# EasyEDA Pro project e_oct_dice_Dec_2022.eprj, schematic e_oct_dice_sch_v0_3
Create Date: 2022-12-15; Page Name: P1; Project Name: e_oct_dice_Dec_2022; Schematic Name: e_oct_dice_sch_v0_3; Update Date: 2023-01-17; Company: CC BY-SA 4.0 International; Drawed: RONG BAO; Page Size: A4; Part Number: P1; Reviewed: RONG BAO; Version: v0.3
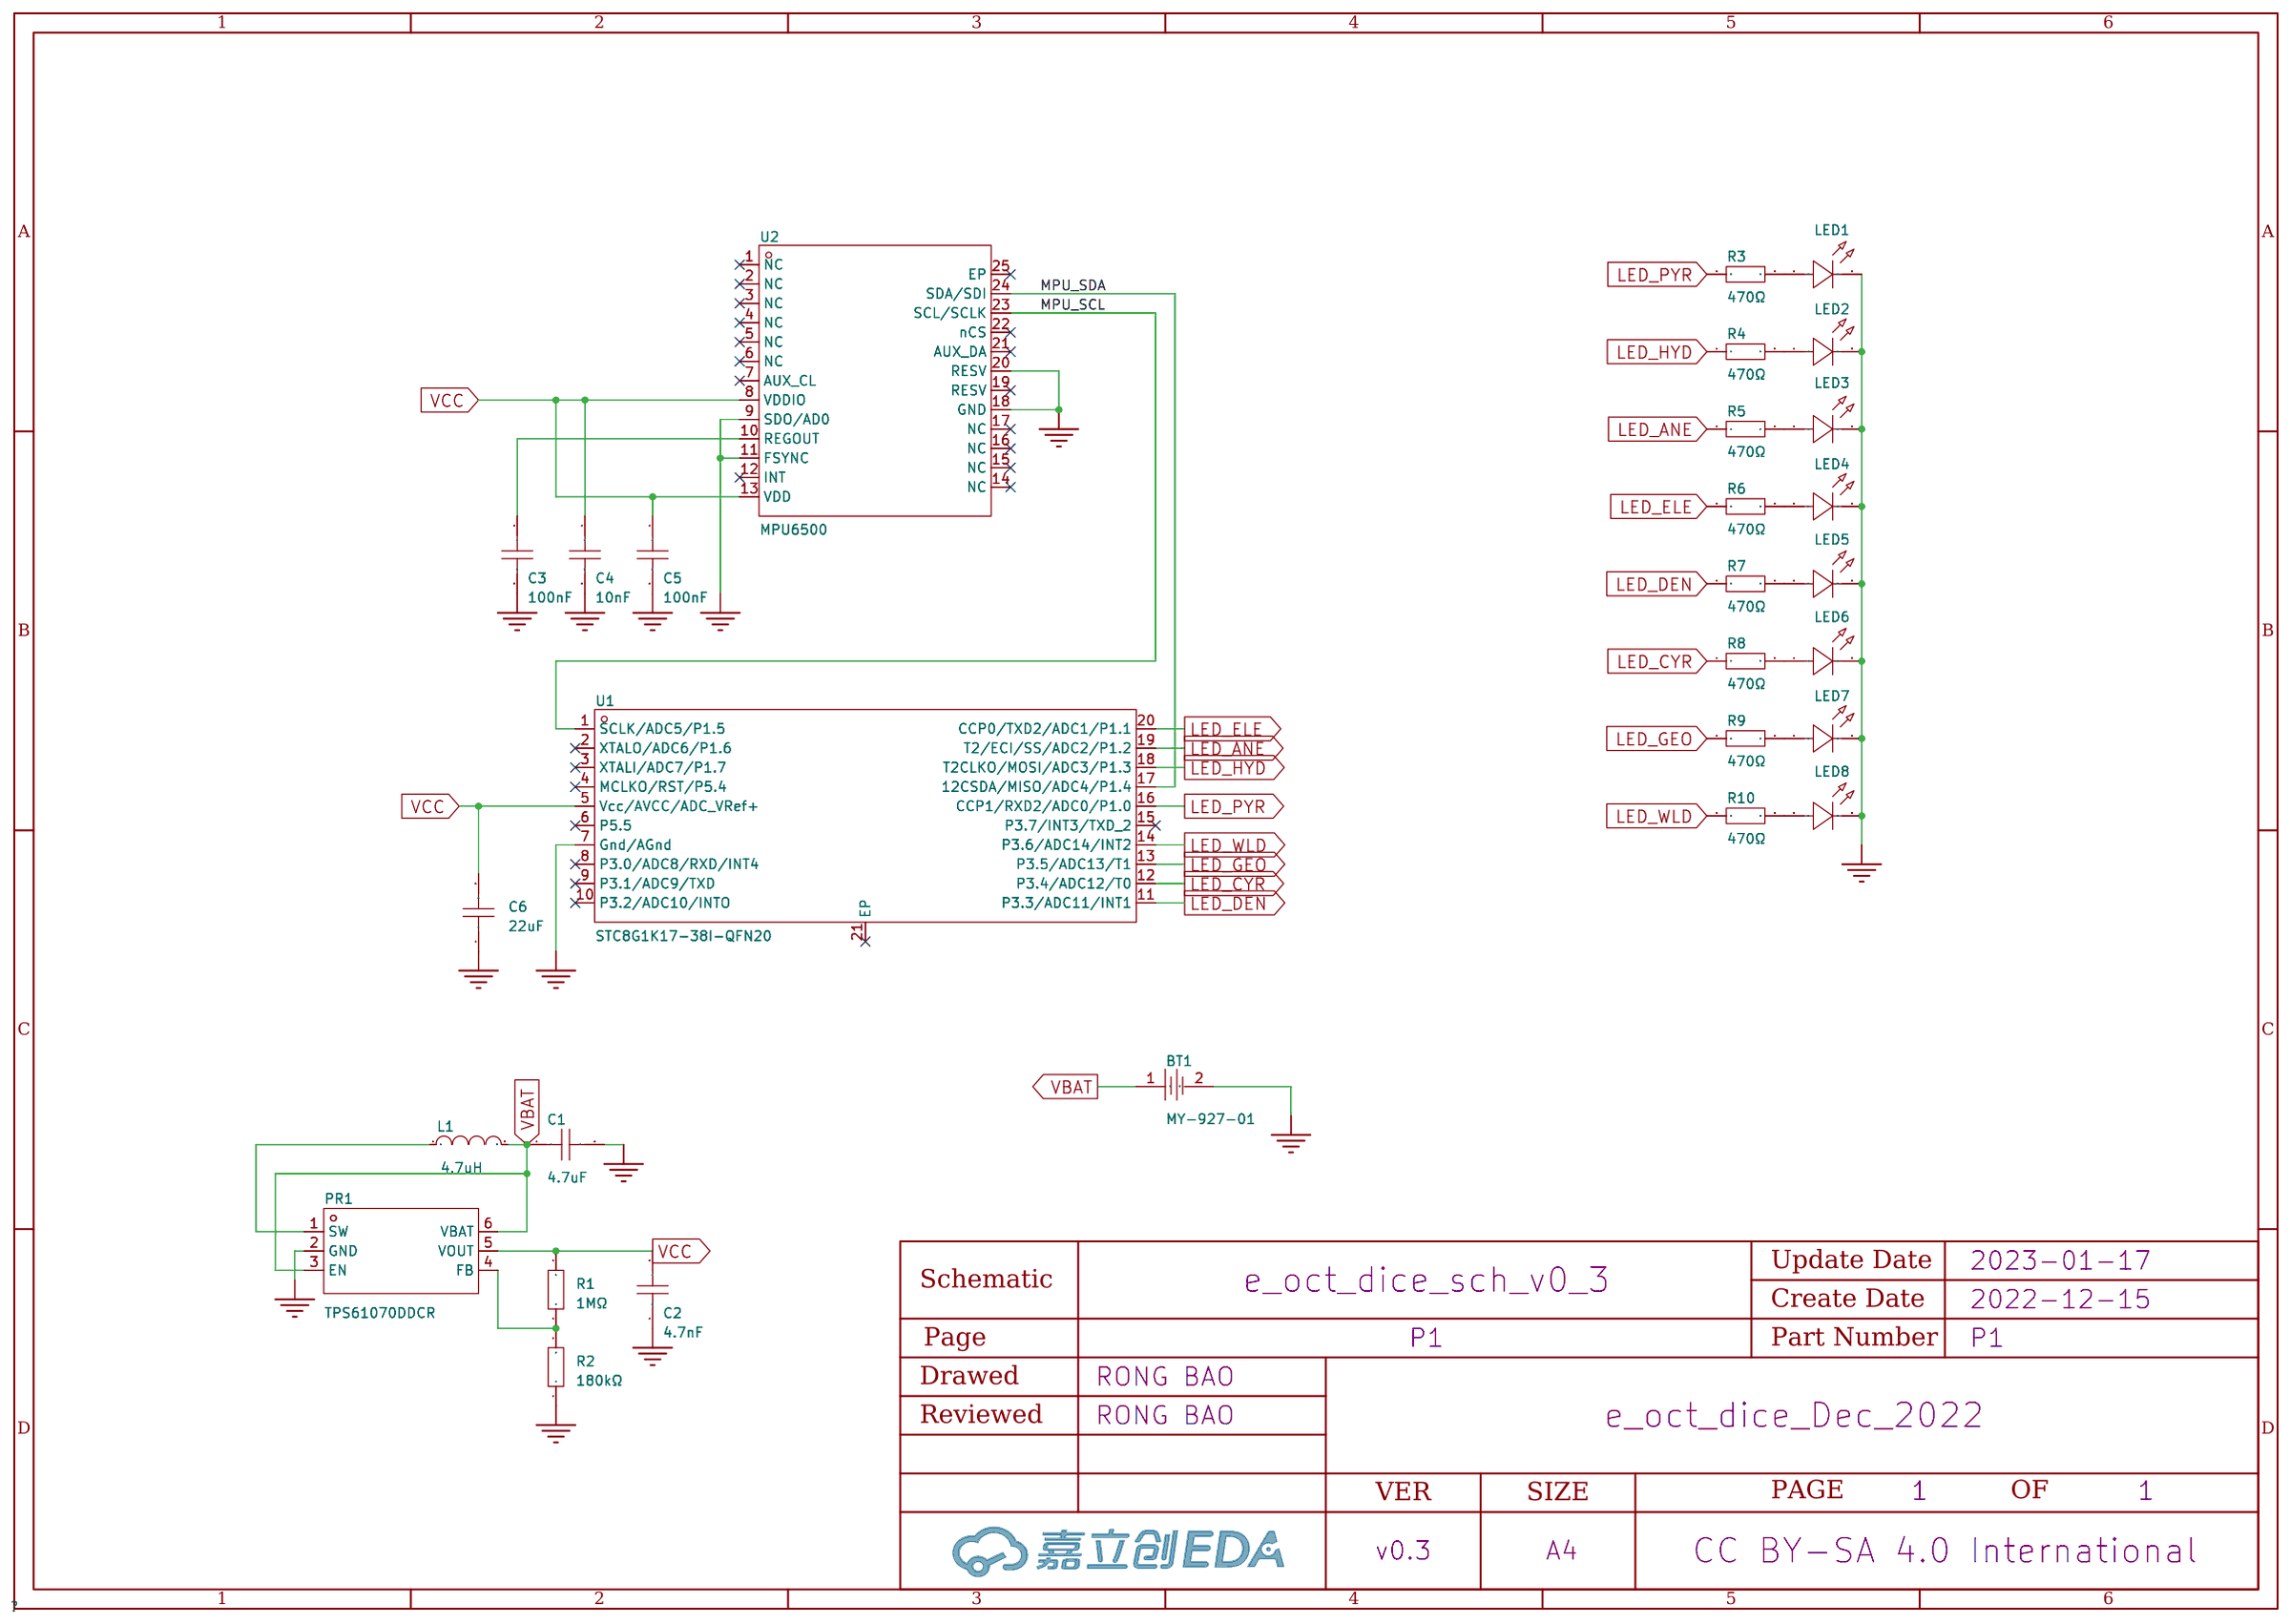
[diagram p1: schematic sheet]

## Parts
BT1  MY-927-01  [BAT-TH_MY-927-01]
C1  4.7uF  [C0402]
C2  4.7nF  [C0402]
C3  100nF  [C0402_NEW]
C4  10nF  [C0402]
C5  100nF  [C0402_NEW]
C6  22uF  [C0603]
L1  4.7uH  [L0603]
LED1  XL-302UWC  [LED-TH_BD3.8-P2.54-FD_WHITE]
LED2  XL-302UWC  [LED-TH_BD3.8-P2.54-FD_WHITE]
LED3  XL-302UWC  [LED-TH_BD3.8-P2.54-FD_WHITE]
LED4  XL-302UWC  [LED-TH_BD3.8-P2.54-FD_WHITE]
LED5  XL-302UWC  [LED-TH_BD3.8-P2.54-FD_WHITE]
LED6  XL-302UWC  [LED-TH_BD3.8-P2.54-FD_WHITE]
LED7  XL-302UWC  [LED-TH_BD3.8-P2.54-FD_WHITE]
LED8  XL-302UWC  [LED-TH_BD3.8-P2.54-FD_WHITE]
PR1  TPS61070DDCR  [SOT-23-6_L2.9-W1.6-P0.95-LS2.8-BR]
R1  1MΩ  [R0402]
R2  180kΩ  [R0603]
R3  470Ω  [R0402]
R4  470Ω  [R0402]
R5  470Ω  [R0402]
R6  470Ω  [R0402]
R7  470Ω  [R0402]
R8  470Ω  [R0402]
R9  470Ω  [R0402]
R10  470Ω  [R0402]
U1  STC8G1K17-38I-QFN20  [TQFN-20L_L3.0-W3.0-P0.40-BL-EP]
U2  MPU6500  [QFN-24_L3.0-W3.0-P0.40-BL-EP]

## Library data of the parts
BT1 = MY-927-01: 连接器类型:电池扣;适用电池规格:CR927;工作温度范围:-;; LCSC Part Name: 电池扣 适用电池:CR927; Supplier Part: C964850; Manufacturer: MYOUNG(美阳); Supplier Footprint: 插件; JLCPCB Part Class: Extended Part; Datasheet: https://atta.szlcsc.com/upload/public/pdf/source/20201218/C964850_48FDFDE1A9A12212C9EC07C1F9ECA79B.pdf; Supplier: LCSC; Connector Type: 电池扣; Battery Type: CR927
C1 = CL05A475MP5NRNC: 容值:4.7uF;精度:±20%;额定电压:10V;材质(温度系数):X5R;; LCSC Part Name: 4.7uF ±20% 10V; Supplier Part: C23733; Manufacturer: SAMSUNG(三星); Supplier Footprint: 0402; JLCPCB Part Class: Basic Part; Datasheet: https://atta.szlcsc.com/upload/public/pdf/source/20160103/1457707710457.pdf; Supplier: LCSC; Tolerance: ±20%; Voltage Rated: 10V; Temperature Coefficient: X5R
C2 = 0402B472K500NT: 温度系数:X7R;精度:±10%;容值:4.7nF;额定电压:50V;; LCSC Part Name: 4.7nF(472) ±10% 50V; Supplier Part: C1538; Manufacturer: FH(风华); Supplier Footprint: 0402; JLCPCB Part Class: Basic Part; Datasheet: https://atta.szlcsc.com/upload/public/pdf/source/20170923/C1538_1506149261557988345.pdf; Supplier: LCSC; Temperature Coefficient: X7R; Tolerance: ±10%; Voltage Rated: 50V
C3 C5 = CL05B104KO5NNNC: 容值:100nF;精度:±10%;额定电压:16V;材质(温度系数):X7R;; LCSC Part Name: 100nF ±10% 16V; Supplier Part: C1525; Manufacturer: SAMSUNG(三星); Supplier Footprint: 0402; JLCPCB Part Class: Basic Part; Datasheet: https://atta.szlcsc.com/upload/public/pdf/source/20160103/1457707674891.pdf; Supplier: LCSC; Tolerance: ±10%; Voltage Rated: 16V; Temperature Coefficient: X7R
C4 = CL05B103KB5NNNC: 容值:10nF;精度:±10%;额定电压:50V;材质(温度系数):X7R;; LCSC Part Name: 10nF ±10% 50V; Supplier Part: C15195; Manufacturer: SAMSUNG(三星); Supplier Footprint: 0402; JLCPCB Part Class: Basic Part; Datasheet: https://atta.szlcsc.com/upload/public/pdf/source/20160103/1457707674468.pdf; Supplier: LCSC; Tolerance: ±10%; Voltage Rated: 50V; Temperature Coefficient: X7R
C6 = CL10A226MQ8NRNC: 容值:22uF;精度:±20%;额定电压:6.3V;材质(温度系数):X5R;; LCSC Part Name: 22uF ±20% 6.3V; Supplier Part: C59461; Manufacturer: SAMSUNG(三星); Supplier Footprint: 0603; JLCPCB Part Class: Basic Part; Datasheet: https://atta.szlcsc.com/upload/public/pdf/source/20160103/1457707740762.pdf; Supplier: LCSC; Tolerance: ±20%; Voltage Rated: 6.3V; Temperature Coefficient: X5R
L1 = SDFL1608Q4R7KTF: 电感值:4.7uH;精度:±10%;额定电流:15mA;饱和电流(Isat):-;直流电阻(DCR):2.1Ω;; LCSC Part Name: 4.7uH ±10% 2.1Ω; Supplier Part: C1034; Manufacturer: Sunlord(顺络); Supplier Footprint: 0603; JLCPCB Part Class: Basic Part; Datasheet: https://atta.szlcsc.com/upload/public/pdf/source/20210816/855F4348312D259031B87CBCF31BE802.pdf; Supplier: LCSC; Tolerance: ±10%; Rated Current: 15mA; DC Resistance (DCR): 2.1Ω; Q @ Freq: 35@10MHz; Frequency - Self Resonant: 10MHz
LED1 = XL-302UWC: 发光颜色:白灯;透镜颜色:无色透明;色温:6000K~6500K;测试电流:20mA;功率:80mW;发光角度:50°;安装方式:-;工作温度:-25℃~+85℃;; LCSC Part Name: 白灯 6000K~6500K; Supplier Part: C2895458; Manufacturer: XINGLIGHT(成兴光); Supplier Footprint: 插件,D=3mm; JLCPCB Part Class: Extended Part; Datasheet: https://atta.szlcsc.com/upload/public/pdf/source/20220816/95DCBD942C61C750E3165A46E2F97F4A.pdf; Supplier: LCSC; Emitted Color: 白灯; Lens Color: 无色透明; Color Temperature: 6000K~6500K; Forward Current: 20mA; Power Dissipation: 80mW; Viewing Angle: 50°; Operating Temperature: -25℃~+85℃; Lamp Holder Type: 3mm圆形灯头; Dominant Wavelength: 624nm; Peak Wavelength: 632nm
LED2 LED4-LED8 = XL-302UWC: 发光颜色:白灯;透镜颜色:无色透明;色温:6000K~6500K;测试电流:20mA;功率:80mW;发光角度:50°;安装方式:-;工作温度:-25℃~+85℃;; LCSC Part Name: 白灯 6000K~6500K; Supplier Part: C2895458; Manufacturer: XINGLIGHT(成兴光); Supplier Footprint: 插件,D=3mm; JLCPCB Part Class: Extended Part; Datasheet: https://atta.szlcsc.com/upload/public/pdf/source/20220816/95DCBD942C61C750E3165A46E2F97F4A.pdf; Supplier: LCSC; Emitted Color: 白灯; Lens Color: 无色透明; Color Temperature: 6000K~6500K; Forward Current: 20mA; Power Dissipation: 80mW; Viewing Angle: 50°; Operating Temperature: -25℃~+85℃; Lamp Holder Type: 3mm圆形灯头
LED3 = XL-302UWC: 发光颜色:白灯;透镜颜色:无色透明;色温:6000K~6500K;测试电流:20mA;功率:80mW;发光角度:50°;安装方式:-;工作温度:-25℃~+85℃;; LCSC Part Name: 白灯 6000K~6500K; Supplier Part: C2895458; Manufacturer: XINGLIGHT(成兴光); Supplier Footprint: 插件,D=3mm; JLCPCB Part Class: Extended Part; Datasheet: https://atta.szlcsc.com/upload/public/pdf/source/20220816/95DCBD942C61C750E3165A46E2F97F4A.pdf; Supplier: LCSC; Emitted Color: 白灯; Lens Color: 无色透明; Color Temperature: 6000K~6500K; Forward Current: 20mA; Power Dissipation: 80mW; Viewing Angle: 50°; Operating Temperature: -25℃~+85℃; Lamp Holder Type: 3mm圆形灯头; Dominant Wavelength: 530nm; Peak Wavelength: 525nm
PR1 = TPS61070DDCR: 功能类型:升压型;同步整流:是;输出类型:可调;输出通道数:1;拓扑结构:升压式;输入电压:0.9V~5.5V;输出电压:1.8V~5.5V;输出电流(最大值):500mA;开关频率:1.2MHz;工作温度:-40℃~+85℃@(TA);; LCSC Part Name: 升压型 Vin=0.9V~5.5V Vout=1.8V~5.5V 500mA; Supplier Part: C9841; Manufacturer: TI(德州仪器); Supplier Footprint: SOT-23-6; JLCPCB Part Class: Extended Part; Datasheet: https://atta.szlcsc.com/upload/public/pdf/source/20121108/1457706555598.pdf; Supplier: LCSC; Function: 升压型; Synchronous Rectification: 是; Output Type: 可调; Number of Outputs: 1; Topology: 升压式; Input Voltage: 0.9V~5.5V; Output Voltage: 1.8V~5.5V; Output Current (Max): 500mA; Switching Frequency: 1.2MHz; Operating Temperature: -40℃~+85℃@(TA)
R1 = 0402WGF1004TCE: 电阻类型:厚膜电阻;阻值:1MΩ;精度:±1%;功率:62.5mW;温度系数:±100ppm/℃;最大工作电压:50V;工作温度范围:-55℃~+155℃;; LCSC Part Name: 1MΩ ±1% 62.5mW; Supplier Part: C26083; Manufacturer: UNI-ROYAL(厚声); Supplier Footprint: 0402; JLCPCB Part Class: Basic Part; Datasheet: https://atta.szlcsc.com/upload/public/pdf/source/20200306/C422600_1E6D84923E4A46A82E41ADD87F860B5C.pdf; Supplier: LCSC; Type: 厚膜电阻; Tolerance: ±1%; Power(Watts): 62.5mW; Temperature Coefficient: ±100ppm/℃; Overload Voltage (Max): 50V; Operating Temperature Range: -55℃~+155℃
R2 = 0603WAF1803T5E: 电阻类型:厚膜电阻;阻值:180kΩ;精度:±1%;功率:100mW;温度系数:±100ppm/℃;最大工作电压:75V;工作温度范围:-55℃~+155℃;; LCSC Part Name: 180kΩ ±1% 100mW; Supplier Part: C22827; Manufacturer: UNI-ROYAL(厚声); Supplier Footprint: 0603; JLCPCB Part Class: Basic Part; Datasheet: https://atta.szlcsc.com/upload/public/pdf/source/20200306/C422600_1E6D84923E4A46A82E41ADD87F860B5C.pdf; Supplier: LCSC; Type: 厚膜电阻; Tolerance: ±1%; Power(Watts): 100mW; Temperature Coefficient: ±100ppm/℃; Overload Voltage (Max): 75V; Operating Temperature Range: -55℃~+155℃
R3-R10 = 0402WGF4700TCE: LCSC Part Name: 470Ω(4700) ±1% 编带; Supplier Part: C25117; Manufacturer: UNI-ROYAL(厚声); Supplier Footprint: 0402; JLCPCB Part Class: Basic Part; Datasheet: https://atta.szlcsc.com/upload/public/pdf/source/20170920/C25117_1505901219153982748.pdf; Supplier: LCSC
U1 = STC8G1K17-38I-QFN20: CPU内核:51系列;CPU最大主频:-;工作电压范围:1.9V~5.5V;内部振荡器:有;外部时钟频率范围:4MHz~33MHz;程序 FLASH容量:17KB;RAM总容量:1.25KB;EEPROM/数据 FLASH容量:-;GPIO端口数量:18;ADC(单元数/通道数/位数):1@x15ch/10bit;DAC(单元数/通道数/位数):-;(E)PWM(单元数/通道数/位数):-;8位Timer数量:-;16位Timer数量:3;32位Timer数量:-;内部比较器数量:1;U(S)ART路数:; LCSC Part Name: 51系列 闪存：17KB RAM：1.25KB; Supplier Part: C521760; Manufacturer: STC(宏晶); Supplier Footprint: TQFN-20L-EP(3x3); JLCPCB Part Class: Extended Part; Datasheet: https://atta.szlcsc.com/upload/public/pdf/source/20200427/C521757_3A42F86F9B1410FBC1EBFB2F2384AA9A.pdf; Supplier: LCSC; CPU Core: 51系列; Supply Voltage Range: 1.9V~5.5V; Internal Oscillator: 有; External Clock Frequency Rang: 4MHz~33MHz; Program FLASH Size: 17KB; RAM Size: 1.25KB; GPIO Ports Number: 18; ADC (Units/Channels/bits): 1@x15ch/10bit; 16Bit Timer Number: 3; CMP Number: 1; U(S)ART Number: 2; I2C Number: 1; (Q)SPI Number: 1; Peripherals / Functions / Protocol Stacks: 低电压检测；看门狗；CCP捕获/比较; Operating Temperature Range: -40℃~+85℃
U2 = MPU6500: Accelerometer, Gyroscope, 3 Axis Sensor I2C, SPI Output; Supplier Part: C50278; Manufacturer: TDK InvenSense(应美盛); Supplier Footprint: QFN-24; JLCPCB Part Class: Extended Part; Datasheet: https://atta.szlcsc.com/upload/public/pdf/source/20170505/1493957890595.pdf; Supplier: LCSC

## Nets
GND: BT1.2 C1.2 C2.1 C3.2 C4.2 C5.2 C6.1 LED1.2(A) LED2.2(A) LED3.2(A) LED4.2(A) LED5.2(A) LED6.2(A) LED7.2(A) LED8.2(A) PR1.2(GND) R2.1 U1.7(Gnd/AGnd) U2.9(SDO/AD0) U2.11(FSYNC) U2.18(GND) U2.20(RESV)
VBAT: BT1.1 C1.1 L1.2 PR1.3(EN) PR1.6(VBAT)
VCC: C2.2 C4.1 C5.1 C6.2 PR1.5(VOUT) R1.2 U1.5(Vcc/AVCC/ADC_VRef+) U2.8(VDDIO) U2.13(VDD)
LED_ANE: R5.1 U1.19(T2/ECI/SS/ADC2/P1.2)
LED_CYR: R8.1 U1.12(P3.4/ADC12/T0)
LED_DEN: R7.1 U1.11(P3.3/ADC11/INT1)
LED_ELE: R6.1 U1.20(CCP0/TXD2/ADC1/P1.1)
LED_GEO: R9.1 U1.13(P3.5/ADC13/T1)
LED_HYD: R4.1 U1.18(T2CLKO/MOSI/ADC3/P1.3)
LED_PYR: R3.1 U1.16(CCP1/RXD2/ADC0/P1.0)
LED_WLD: R10.1 U1.14(P3.6/ADC14/INT2)
MPU_SCL: U1.1(SCLK/ADC5/P1.5) U2.23(SCL/SCLK)
MPU_SDA: U1.17(12CSDA/MISO/ADC4/P1.4) U2.24(SDA/SDI)
$1N1768: L1.1 PR1.1(SW)
$1N1911: PR1.4(FB) R1.1 R2.2
$1N2923: C3.1 U2.10(REGOUT)
$1N36634: LED1.1(K) R3.2
$1N36786: LED2.1(K) R4.2
$1N36892: LED3.1(K) R5.2
$1N36980: LED4.1(K) R6.2
$1N37068: LED5.1(K) R7.2
$1N37156: LED6.1(K) R8.2
$1N37244: LED7.1(K) R9.2
$1N37332: LED8.1(K) R10.2

Not connected (* = marked no-connect by the designer): U1 2(XTALO/ADC6/P1.6)* 3(XTALI/ADC7/P1.7)* 4(MCLKO/RST/P5.4)* 6(P5.5)* 8(P3.0/ADC8/RXD/INT4)* 9(P3.1/ADC9/TXD)* 10(P3.2/ADC10/INTO)* 15(P3.7/INT3/TXD_2)* 21(EP)*; U2 1(NC)* 2(NC)* 3(NC)* 4(NC)* 5(NC)* 6(NC)* 7(AUX_CL)* 12(INT)* 14(NC)* 15(NC)* 16(NC)* 17(NC)* 19(RESV)* 21(AUX_DA)* 22(nCS)* 25(EP)*
